# Altium schematic sheet Connectors.SchDoc: Connectors/Power
size A; DrawnBy: Matt Harlum; Engineer: Matt Harlum
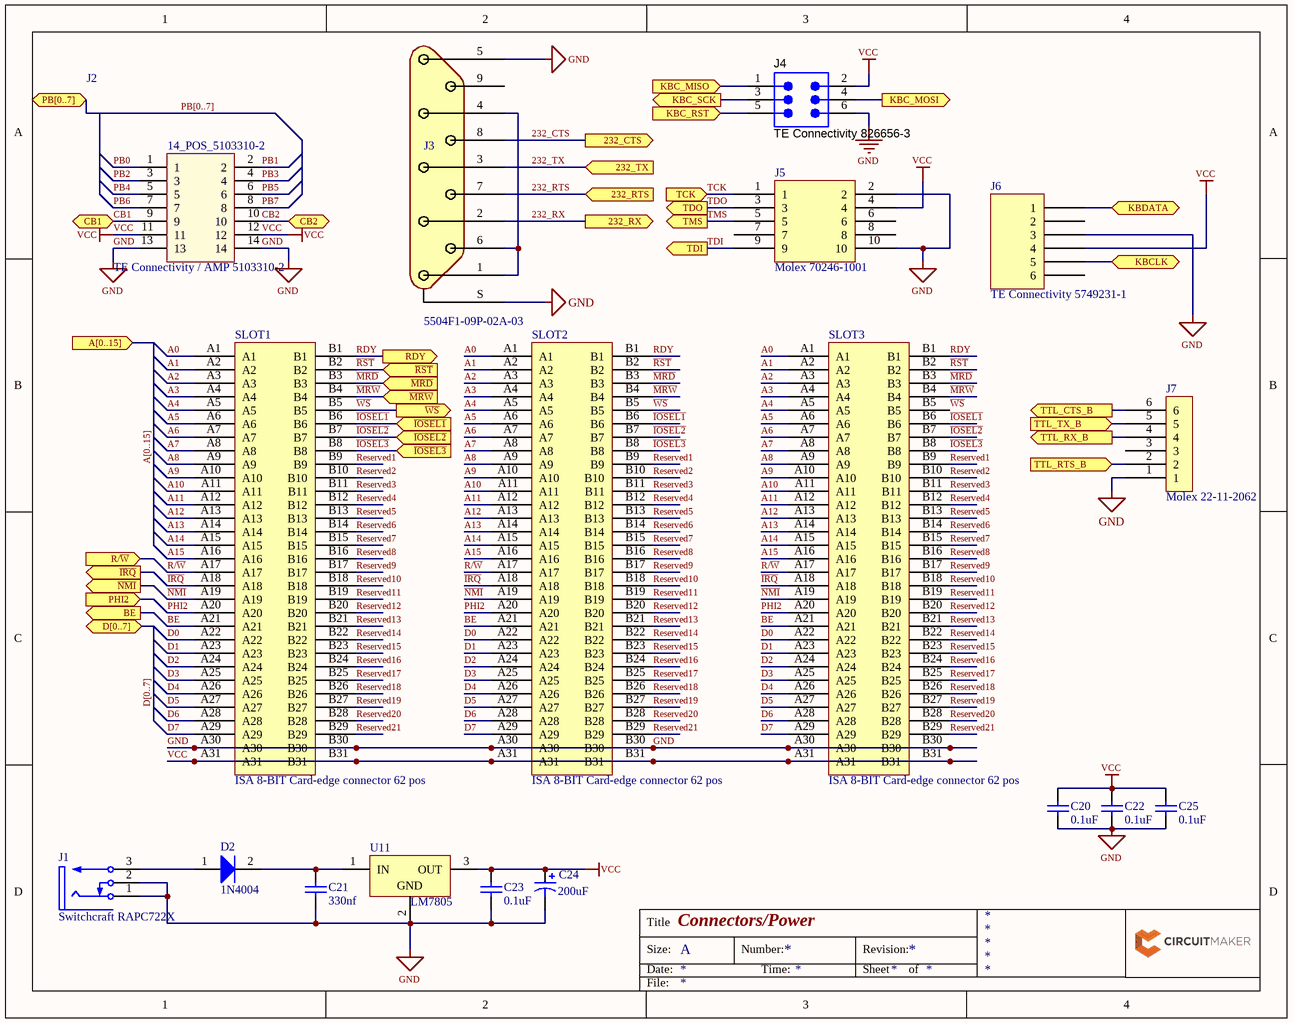
[diagram p0: Connectors.SchDoc]

## Parts
C20  0.1uF  [CAPC1608X90X35NL15T15]
C21  330nf  [CAPC1608X90X35LL15T15]
C22  0.1uF  [CAPC1608X90X35NL15T15]
C23  0.1uF  [CAPC1608X90X35NL15T15]
C24  200uF  [PCB-3fis2k4xlpvnsk81kkhj-1]
C25  0.1uF  [CAPC1608X90X35NL15T15]
D2  1N4004  [DO-41]
J1  Switchcraft RAPC722X  [PCB-1fbtkpzwj6p6nhvlt2g3-1]
J2  TE Connectivity / AMP 5103310-2  [PCB-04n3ni4juo6m1dp788kb-1]
J3  5504F1-09P-02A-03  [PCB-jud4hregttv4p5s2mrjr-1]
J4  TE Connectivity 826656-3  [2X03]
J5  Molex 70246-1001  [PCB-nsgmebcr356so910k4yq-1]
J6  TE Connectivity 5749231-1  [PCB-8pubcbuq08v906tmuwpg-1]
J7  Molex 22-11-2062  [PCB-ioqv0i4y8bkpr9lvorvl-1]
SLOT1  ISA 8-BIT Card-edge connector 62 pos  [PCB-80bthpdokcyhcgmko2pj-1]
SLOT2  ISA 8-BIT Card-edge connector 62 pos  [PCB-80bthpdokcyhcgmko2pj-1]
SLOT3  ISA 8-BIT Card-edge connector 62 pos  [PCB-80bthpdokcyhcgmko2pj-1]
U11  LM7805  [PCB-6qghvgu276ezulagx1yw-1]

## Ports
232_CTS (out), 232_RTS (in), 232_RX (out), 232_TX (in), A[0..15] (in), BE (out), CB1, CB2, D[0..7], KBC_MISO (in), KBC_MOSI (out), KBC_RST (in), KBC_SCK (out), KBCLK, KBDATA (bidir), PB[0..7], PHI2 (in), R/~{W} (in), RDY (out), TCK (in), TDI (out), TDO (out), TMS (out), TTL_CTS_B (out), TTL_RTS_B (in), TTL_RX_B (out), TTL_TX_B (in), ~{IOSEL1} (in), ~{IOSEL2} (in), ~{IOSEL3} (in), ~{IRQ} (out), ~{MRD} (in), ~{MRW} (in), ~{NMI} (out), ~{RST} (in), ~{WS} (out)

## Nets
GND: C20.2 C21.1 C22.2 C23.1 C24.2 C25.2 J1.1(SLEEVE) J1.2(SHUNT) J2.13 J2.14 J3.5 J3.S J4.6 J5.2 J5.10 J6.3 J7.1 SLOT1.A30 SLOT1.B30 SLOT2.A30 SLOT2.B30 SLOT3.A30 SLOT3.B30 U11.2(GND)
VCC: C20.1 C22.1 C23.2 C24.1 C25.1 J2.11 J2.12 J4.2 J5.4 J6.4 SLOT1.A31 SLOT1.B31 SLOT2.A31 SLOT2.B31 SLOT3.A31 SLOT3.B31 U11.3(OUT)
232_CTS: J3.8 ; port 232_CTS
232_RTS: J3.7 ; port 232_RTS
232_RX: J3.2 ; port 232_RX
232_TX: J3.3 ; port 232_TX
A0: SLOT1.A1 SLOT2.A1 SLOT3.A1
A1: SLOT1.A2 SLOT2.A2 SLOT3.A2
A2: SLOT1.A3 SLOT2.A3 SLOT3.A3
A3: SLOT1.A4 SLOT2.A4 SLOT3.A4
A4: SLOT1.A5 SLOT2.A5 SLOT3.A5
A5: SLOT1.A6 SLOT2.A6 SLOT3.A6
A6: SLOT1.A7 SLOT2.A7 SLOT3.A7
A7: SLOT1.A8 SLOT2.A8 SLOT3.A8
A8: SLOT1.A9 SLOT2.A9 SLOT3.A9
A9: SLOT1.A10 SLOT2.A10 SLOT3.A10
A10: SLOT1.A11 SLOT2.A11 SLOT3.A11
A11: SLOT1.A12 SLOT2.A12 SLOT3.A12
A12: SLOT1.A13 SLOT2.A13 SLOT3.A13
A13: SLOT1.A14 SLOT2.A14 SLOT3.A14
A14: SLOT1.A15 SLOT2.A15 SLOT3.A15
A15: SLOT1.A16 SLOT2.A16 SLOT3.A16
BE: SLOT1.A21 SLOT2.A21 SLOT3.A21 ; port BE
CB1: J2.9 ; port CB1
CB2: J2.10 ; port CB2
D0: SLOT1.A22 SLOT2.A22 SLOT3.A22
D1: SLOT1.A23 SLOT2.A23 SLOT3.A23
D2: SLOT1.A24 SLOT2.A24 SLOT3.A24
D3: SLOT1.A25 SLOT2.A25 SLOT3.A25
D4: SLOT1.A26 SLOT2.A26 SLOT3.A26
D5: SLOT1.A27 SLOT2.A27 SLOT3.A27
D6: SLOT1.A28 SLOT2.A28 SLOT3.A28
D7: SLOT1.A29 SLOT2.A29 SLOT3.A29
~{IOSEL1}: SLOT1.B6 SLOT2.B6 SLOT3.B6 ; port ~{IOSEL1}
~{IOSEL2}: SLOT1.B7 SLOT2.B7 SLOT3.B7 ; port ~{IOSEL2}
~{IOSEL3}: SLOT1.B8 SLOT2.B8 SLOT3.B8 ; port ~{IOSEL3}
~{IRQ}: SLOT1.A18 SLOT2.A18 SLOT3.A18 ; port ~{IRQ}
KBC_MISO: J4.1 ; port KBC_MISO
KBC_MOSI: J4.4 ; port KBC_MOSI
KBC_RST: J4.5 ; port KBC_RST
KBC_SCK: J4.3 ; port KBC_SCK
KBCLK: J6.5 ; port KBCLK
KBDATA: J6.1 ; port KBDATA
~{MRD}: SLOT1.B3 SLOT2.B3 SLOT3.B3 ; port ~{MRD}
~{MRW}: SLOT1.B4 SLOT2.B4 SLOT3.B4 ; port ~{MRW}
~{NMI}: SLOT1.A19 SLOT2.A19 SLOT3.A19 ; port ~{NMI}
PB0: J2.1
PB1: J2.2
PB2: J2.3
PB3: J2.4
PB4: J2.5
PB5: J2.6
PB6: J2.7
PB7: J2.8
PHI2: SLOT1.A20 SLOT2.A20 SLOT3.A20 ; port PHI2
R/~{W}: SLOT1.A17 SLOT2.A17 SLOT3.A17 ; port R/~{W}
~{RST}: SLOT1.B2 SLOT2.B2 SLOT3.B2 ; port ~{RST}
RDY: SLOT1.B1 SLOT2.B1 SLOT3.B1 ; port RDY
Reserved1: SLOT1.B9 SLOT2.B9 SLOT3.B9
Reserved2: SLOT1.B10 SLOT2.B10 SLOT3.B10
Reserved3: SLOT1.B11 SLOT2.B11 SLOT3.B11
Reserved4: SLOT1.B12 SLOT2.B12 SLOT3.B12
Reserved5: SLOT1.B13 SLOT2.B13 SLOT3.B13
Reserved6: SLOT1.B14 SLOT2.B14 SLOT3.B14
Reserved7: SLOT1.B15 SLOT2.B15 SLOT3.B15
Reserved8: SLOT1.B16 SLOT2.B16 SLOT3.B16
Reserved9: SLOT1.B17 SLOT2.B17 SLOT3.B17
Reserved10: SLOT1.B18 SLOT2.B18 SLOT3.B18
Reserved11: SLOT1.B19 SLOT2.B19 SLOT3.B19
Reserved12: SLOT1.B20 SLOT2.B20 SLOT3.B20
Reserved13: SLOT1.B21 SLOT2.B21 SLOT3.B21
Reserved14: SLOT1.B22 SLOT2.B22 SLOT3.B22
Reserved15: SLOT1.B23 SLOT2.B23 SLOT3.B23
Reserved16: SLOT1.B24 SLOT2.B24 SLOT3.B24
Reserved17: SLOT1.B25 SLOT2.B25 SLOT3.B25
Reserved18: SLOT1.B26 SLOT2.B26 SLOT3.B26
Reserved19: SLOT1.B27 SLOT2.B27 SLOT3.B27
Reserved20: SLOT1.B28 SLOT2.B28 SLOT3.B28
Reserved21: SLOT1.B29 SLOT2.B29 SLOT3.B29
TCK: J5.1 ; port TCK
TDI: J5.9 ; port TDI
TDO: J5.3 ; port TDO
TMS: J5.5 ; port TMS
TTL_CTS_B: J7.6 ; port TTL_CTS_B
TTL_RTS_B: J7.2 ; port TTL_RTS_B
TTL_RX_B: J7.4 ; port TTL_RX_B
TTL_TX_B: J7.5 ; port TTL_TX_B
~{WS}: SLOT1.B5 SLOT2.B5 SLOT3.B5 ; port ~{WS}
NetC21_2: C21.2 D2.2(-) U11.1(IN)
NetD2_1: D2.1(+) J1.3(TIP)
NetJ3_1: J3.1 J3.4 J3.6

Not connected (* = marked no-connect by the designer): J3 9; J5 6 7 8; J6 2 6; J7 3

## Buses and harness runs
bus A[0..15] = port A[0..15]
bus D[0..7] = port D[0..7]
bus PB[0..7] = port PB[0..7]

## Notes on the sheet
- Title
- Size:
- Date:
- A
- Number:
- Time:
- Revision:
- Sheet
- of
- File:
- (in symbol CMP-1a3bd16bc3bbc5fc-4) 14_POS_5103310-2

## Library data of the parts
C20 C22 C23 C25 = CMP-15328962-11: 0603 0.1uF Capacitor; Insulation Resistance: 1e+11 Ω; Voltage Rating (DC): 16.0 V; Lead-Free Status: Lead Free; Dielectric Material: Ceramic Multilayer; Dielectric Characteristic: X7R; Capacitance Tolerance: ±10%; Capacitance: 1e-07 F; OctopartID: 0cd5c6920958d312; Number of Pins: 2; Size-Length: 0.0016002 m; Octopart Url: https://octopart.com/0603yc104kat2a-avx+interconnect+%2F+elco-55386347; Size-Height: 0.00086 m; Case/Package: 0603; REACH SVHC Compliance: No SVHC; RoHS: Compliant; Mounting Style: Surface Mount; Size-Width: 0.0008128 m
C21 = CMP-126208-2: CAP CER 0.33UF 16V 10% X5R 0603; Capacitance: 3.3e-07 F; Dielectric Material: Ceramic Multilayer; Lead-Free Status: Lead Free; Voltage Rating (DC): 16.0 V; Capacitance Tolerance: ±10%; Case/Package: 0603; Dielectric Characteristic: X5R; Mounting Style: Surface Mount; Number of Pins: 2; Octopart Url: https://octopart.com/0603yd334kat2a-avx+interconnect+%2F+elco-194839; OctopartID: aae063e876917527; REACH SVHC Compliance: No SVHC; RoHS: Compliant; Size-Height: 0.00086 m; Size-Length: 0.0016 m; Size-Width: 0.00081 m
C24 = CMP-1635dc727a7cc9f2-2: Cap Aluminum 1000uF 16V 20% (10 X 16mm) Radial Aluminum Cylindrical Can 5mm 680mA 2000 hr 85°C Bulk; Manufacturer Part Number: ECA1CM102; Lead-Free Status: Lead Free; Capacitance: 1.00 mF; Dielectric Material: Aluminum Electrolytic; Voltage Rating (DC): 16.0 V; OctopartID: 1635dc727a7cc9f2; Number of Pins: 2; Mounting Style: Through Hole; Lifecycle Status: Not Listed by Manufacturer; Packaging: Bulk; Size-Length: 16.0 mm; RoHS: Compliant; Size-Diameter: 10.0 mm; Octopart URL: http://octopart.com/eca1cm102-panasonic-55396655
D2 = CMP-ed1b2415222e32dc-2: 1N400 Series 400 V 1 A Through Hole General Purpose Rectifier - DO-41; Lead-Free Status: Lead Free; Case/Package: DO-41; RoHS: Compliant; Mounting Style: SMD; Seller Landing  Url: https://octopart-clicks.com/click/track?country=US&ak=8157f166&sig=00ee7fd&sid=2402&ppid=322131&vpid=21812655&ct=offers
J1 = CMP-da391331d91005fe-5: Conn; AV; Power; Jack; Mini; 2.0mmPinDia; RtAngle; Thru-hole; forS760, S765Plug; Current Rating: 5.0 A; Gender: Female; Number of Contacts: 24; Mounting Angle: 90.0 °; Lead-Free Status: Lead Free; Voltage Rating (AC): 250.0 V; Mounting Style: Through Hole, PCB, Solder; Octopart URL: http://octopart.com/rapc722x-switchcraft-140879; RoHS: Compliant; Packaging: Bulk; Color: Black; OctopartID: da391331d91005fe; Contact Plating: Nickel; REACH SVHC Compliance: No SVHC; Manufacturer Part Number: RAPC722X
J2 = CMP-1a3bd16bc3bbc5fc-4: Pin strip Contact spacing: 2.54 mm Total number of pins: 14 TE Connectivity 1 pc(s)
J3 = CMP-0794cfbf94bad853-6: D SUB CONNECTOR, PADS +40%, STANDARD, 9POS, PLUG; Connector Type: D Sub; No. of Contacts: 9; D Sub Shell Size: DE; Connector Bod...; Number of Contacts: 9; RoHS: Exempt; REACH SVHC Compliance: No SVHC; Manufacturer Part Number: 5504F1-09P-02A-03; Contact Plating: Gold
J4 = CMP-664156-9: TE Connectivity AMPMODU Series, 2.54mm Pitch 6 Way 2 Row Straight PCB Header, Solder Termination, 3A; CiivaID: 664156; Pitch: 0.100" (2.54mm); Connector Type: Header, Unshrouded, Breakaway; Number of Positions: 6; 3D Model: 826656-3.pdf; Number of Positions Loaded: All; RoHS Information: 826656-3 Statement of Compliance; Series: AMPMODU Mod II; Contact Finish Thickness: 31.5µin (0.80µm); Number of Rows: 2; Standard Package: 3,024; Termination: Solder; Contact Type: Male Pin; Packaging: Bulk; Row Spacing: 0.100" (2.54mm); Color: Green; Contact Finish: Gold; Family: Rectangular Connectors - Headers, Male Pins; Mounting Type: Through Hole; Ciiva URL: https://ciiva.com/part/826656-3-664156; Manufacturer Part Number: 826656-3; Contact Mating Length: 0.228" (5.80mm); Category: Connectors, Interconnects
J5 = CMP-470a8e03b20998cd-2: Conn Shrouded Header HDR 10 POS 2.54mm Solder ST Thru-Hole C-Grid???? Tray; Gender: Male; Current Rating: 2.50 A; Number of Positions: 10; Insulation Resistance: 12.0 GΩ; ELV Compliant: Compliant; Voltage Rating (DC): 250 V; Size-Height: 9.27 mm; Packaging: Tray; Halogen Free Status: Not Low Halogen; Size-Width: 8.89 mm; Contact Plating: Gold; Color: Black; Number of Rows: 2; OctopartID: 470a8e03b20998cd; Octopart URL: http://octopart.com/70246-1001-molex-249957; RoHS: Compliant; Housing Material: Polyester; Manufacturer Part Number: 70246-1001; Housing Color: Black; Flammability Rating: UL 94 V-0; Pin Pitch: 2.54 mm; REACH SVHC Compliance: No SVHC; Mounting Style: Through Hole; Size-Length: 20.3 mm; Orientation: Vertical; Contact Material: Phosphor Bronze
J6 = CMP-b8aa73653b4d676d-4: Conn Miniature Circular DIN RCP 6 POS Solder RA Thru-Hole 6 Terminal 1 Port Tube; Number of Contacts: 6; Gender: Female; Lead-Free Status: Lead Free; Current Rating: 1.0 A; ELV Compliant: Compliant; Shielding: Yes; Flammability Rating: UL 94 V-0; Manufacturer Part Number: 5749231-1; Lifecycle Status: Active; Contact Material: Copper Alloy; OctopartID: b8aa73653b4d676d; RoHS: Compliant; Contact Plating: Tin, Gold Flash; Packaging: Tube; Color: Black; Mounting Style: Through Hole; Orientation: Right Angle; Housing Material: Thermoplastic; Housing Color: Black; Octopart URL: http://octopart.com/5749231-1-te+connectivity-46507649; Number of Positions: 6; REACH SVHC Compliance: No SVHC
J7 = CMP-4b8d8287433d944a-2: KK® 254 Solid Header, Vertical, with Friction Lock, 6 Circuits, Gold (Au) Plating
SLOT1 = ISA 8-BIT Card-edge connector 62 pos-2: 62 pos card-edge connector; CustomComponentID: pbfl1llzq4ddr18jwana
SLOT2 SLOT3 = CMP-pbfl1llzq4ddr18jwana-2: 62 pos card-edge connector
U11 = CMP-756abc604f31aaad-2: Linear Voltage Regulator, Positive, 5.0 V, 1.0 A Vout: 5.0 V; TJ = 0°C to +125°C